# Altium schematic sheet WIFI and BLE.SchDoc
size 420 x 297 mm; SheetNumber: 8; SheetTotal: 16
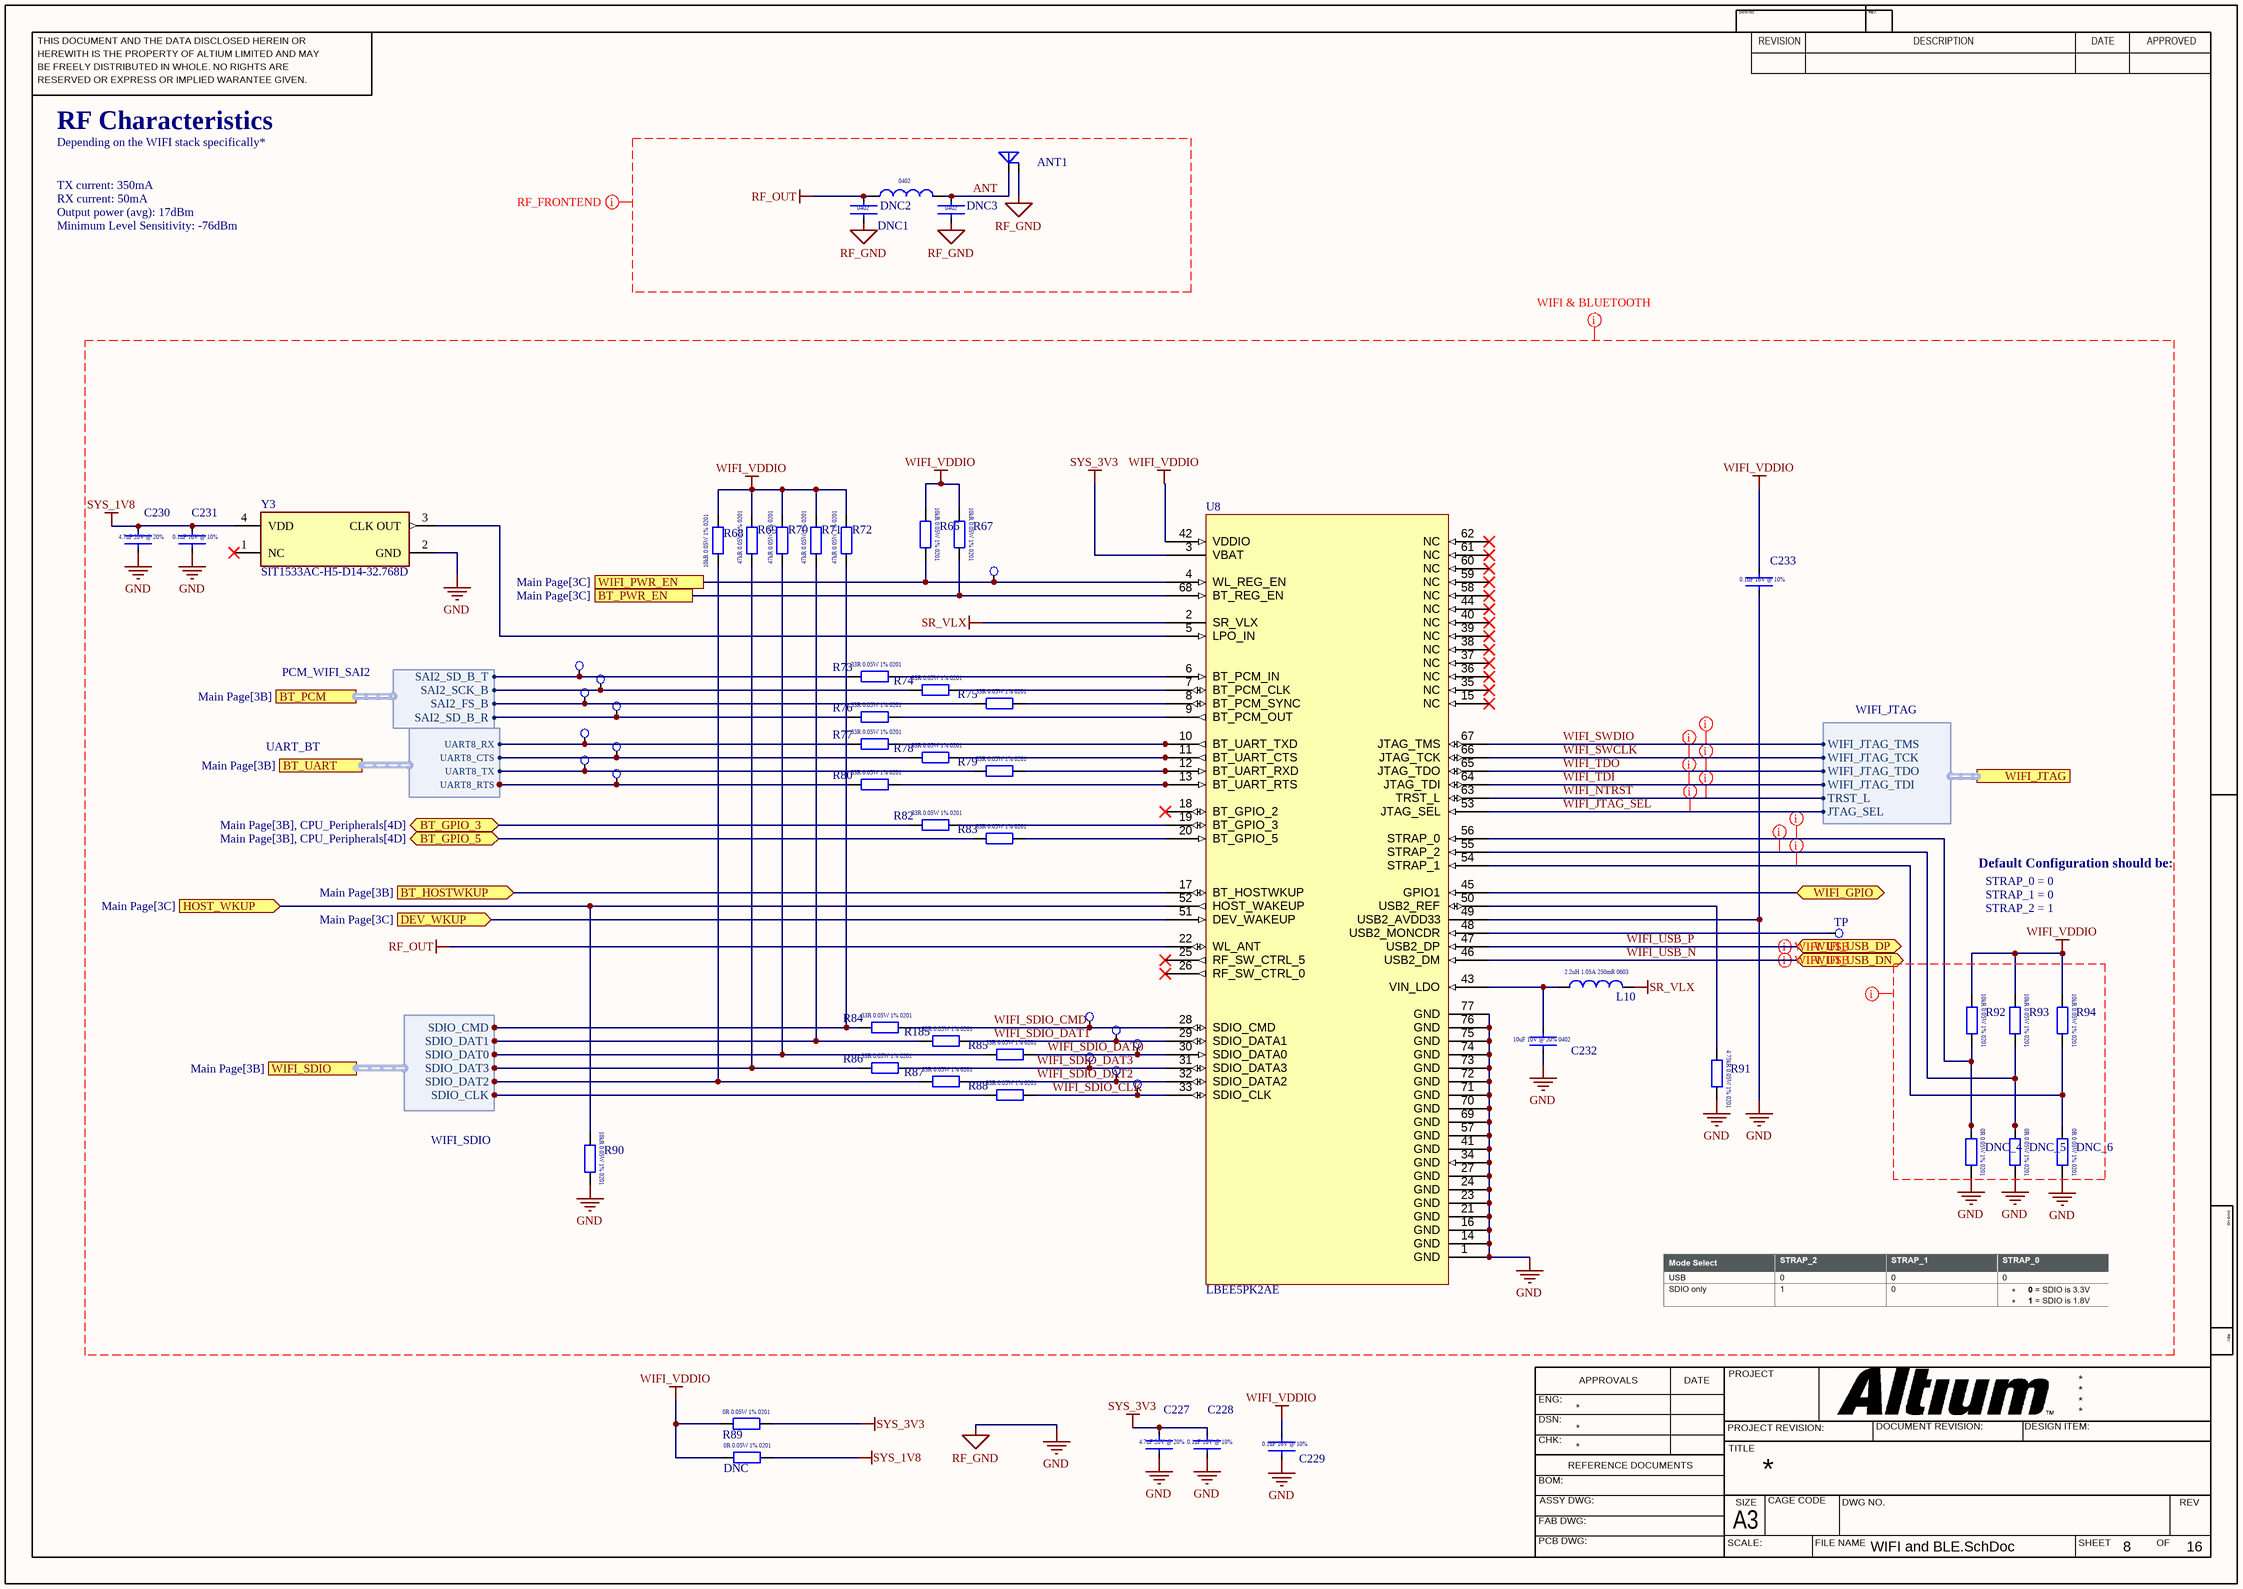
[diagram p0: WIFI and BLE.SchDoc]

## Parts
ANT1  ANT5320LL24R2455A  [ANT5320LL24R2455A]  (value not drawn)
C227  4.7uF  [CAPC1005X06L]  (value not drawn)
C228  0.1uF  [CAPC0603X03L]  (value not drawn)
C229  0.1uF  [CAPC0603X03L]  (value not drawn)
C230  4.7uF  [CAPC1005X06L]  (value not drawn)
C231  0.1uF  [CAPC0603X03L]  (value not drawn)
C232  GRT155R61A106ME13J  [CAPC1005X06L]  (value not drawn)
C233  0.1uF  [CAPC0603X03L]  (value not drawn)
DNC  ERJ-1GN0R00C  [RESC0603X03L]  (value not drawn)
DNC1  RF_GND_PI  [CAPC1005X06L]  (value not drawn)
DNC2  DNC RF Inductor  [RESC1005X04L]  (value not drawn)
DNC3  RF_GND_PI  [CAPC1005X06L]  (value not drawn)
DNC_4  ERJ-1GN0R00C  [RESC0603X03L]  (value not drawn)
DNC_5  ERJ-1GN0R00C  [RESC0603X03L]  (value not drawn)
DNC_6  ERJ-1GN0R00C  [RESC0603X03L]  (value not drawn)
L10  LQM18PN2R2MGHD  [INDC1608LPX08L]  (value not drawn)
R66  ERJ-1GNF1002C  [RESC0603X03L]  (value not drawn)
R67  ERJ-1GNF1002C  [RESC0603X03L]  (value not drawn)
R68  ERJ-1GNF1002C  [RESC0603X03L]  (value not drawn)
R69  AC0201FR-0747KL  [RESC0603X03L]  (value not drawn)
R70  AC0201FR-0747KL  [RESC0603X03L]  (value not drawn)
R71  AC0201FR-0747KL  [RESC0603X03L]  (value not drawn)
R72  AC0201FR-0747KL  [RESC0603X03L]  (value not drawn)
R73  ERJ-1GNF33R0C  [RESC0603X03L]  (value not drawn)
R74  ERJ-1GNF33R0C  [RESC0603X03L]  (value not drawn)
R75  ERJ-1GNF33R0C  [RESC0603X03L]  (value not drawn)
R76  ERJ-1GNF33R0C  [RESC0603X03L]  (value not drawn)
R77  ERJ-1GNF33R0C  [RESC0603X03L]  (value not drawn)
R78  ERJ-1GNF33R0C  [RESC0603X03L]  (value not drawn)
R79  ERJ-1GNF33R0C  [RESC0603X03L]  (value not drawn)
R80  ERJ-1GNF33R0C  [RESC0603X03L]  (value not drawn)
R82  ERJ-1GNF33R0C  [RESC0603X03L]  (value not drawn)
R83  ERJ-1GNF33R0C  [RESC0603X03L]  (value not drawn)
R84  ERJ-1GNF33R0C  [RESC0603X03L]  (value not drawn)
R85  ERJ-1GNF33R0C  [RESC0603X03L]  (value not drawn)
R86  ERJ-1GNF33R0C  [RESC0603X03L]  (value not drawn)
R87  ERJ-1GNF33R0C  [RESC0603X03L]  (value not drawn)
R88  ERJ-1GNF33R0C  [RESC0603X03L]  (value not drawn)
R89  ERJ-1GN0R00C  [RESC0603X03L]  (value not drawn)
R90  ERJ-1GNF1002C  [RESC0603X03L]  (value not drawn)
R91  AC0201FR-074K75L  [RESC0603X03L]  (value not drawn)
R92  ERJ-1GNF1002C  [RESC0603X03L]  (value not drawn)
R93  ERJ-1GNF1002C  [RESC0603X03L]  (value not drawn)
R94  ERJ-1GNF1002C  [RESC0603X03L]  (value not drawn)
R185  ERJ-1GNF33R0C  [RESC0603X03L]  (value not drawn)
TP  Test Point  [Test Point]  (value not drawn)
TP1  Test Point  [Test Point]  (value not drawn)
TP2  Test Point  [Test Point]  (value not drawn)
TP3  Test Point  [Test Point]  (value not drawn)
TP4  Test Point  [Test Point]  (value not drawn)
TP5  Test Point  [Test Point]  (value not drawn)
TP6  Test Point  [Test Point]  (value not drawn)
TP21  Test Point  [Test Point]  (value not drawn)
TP22  Test Point  [Test Point]  (value not drawn)
TP23  Test Point  [Test Point]  (value not drawn)
TP24  Test Point  [Test Point]  (value not drawn)
TP25  Test Point  [Test Point]  (value not drawn)
TP26  Test Point  [Test Point]  (value not drawn)
TP27  Test Point  [Test Point]  (value not drawn)
TP28  Test Point  [Test Point]  (value not drawn)
TP40  Test Point  [Test Point]  (value not drawn)
U8  LBEE5PK2AE  [LBEE5PK2AE]
Y3  SIT1533AC-H5-D14-32.768D  [FP-SiT1533-H-MFG]

## Ports
BT_GPIO_3 (bidir, see Main Page[3B], CPU_Peripherals[4D]), BT_GPIO_5 (bidir, see Main Page[3B], CPU_Peripherals[4D]), BT_HOSTWKUP (in, see Main Page[3B]), BT_PCM (harness PCM_WIFI_SAI2, see Main Page[3B]), BT_PWR_EN (see Main Page[3C]), BT_UART (harness UART_BT, see Main Page[3B]), DEV_WKUP (in, see Main Page[3C]), HOST_WKUP (in, see Main Page[3C]), WIFI_GPIO (bidir, see Main Page[3B], CPU_Peripherals[4E]), WIFI_JTAG (harness WIFI_JTAG, see Main Page[2B], Connector A[1B]), WIFI_PWR_EN (see Main Page[3C]), WIFI_SDIO (harness WIFI_SDIO, see Main Page[3B]), WIFI_USB_DN (bidir, see Main Page[3C]), WIFI_USB_DP (bidir, see Main Page[3C])

## Harnesses
WIFI_JTAG: WIFI_JTAG_TMS, WIFI_JTAG_TCK, WIFI_JTAG_TDO, WIFI_JTAG_TDI, TRST_L, JTAG_SEL
PCM_WIFI_SAI2: SAI2_FS_B, SAI2_SCK_B, SAI2_SD_B_R, SAI2_SD_B_T
WIFI_SDIO: SDIO_CLK, SDIO_CMD, SDIO_DAT0, SDIO_DAT1, SDIO_DAT2, SDIO_DAT3
UART_BT: UART8_CTS, UART8_RTS, UART8_RX, UART8_TX

## Nets
GND: ANT1.3(GND) C227.1 C228.1 C229.1 C230.1 C231.1 C232.1 C233.1 DNC1.1 DNC3.1 DNC_4.2 DNC_5.2 DNC_6.2 R90.2 R91.2 U8.1(GND) U8.14(GND) U8.16(GND) U8.21(GND) U8.23(GND) U8.24(GND) U8.27(GND) U8.34(GND) U8.41(GND) U8.49(USB2_AVDD33) U8.57(GND) U8.69(GND) U8.70(GND) U8.71(GND) U8.72(GND) U8.73(GND) U8.74(GND) U8.75(GND) U8.76(GND) U8.77(GND) Y3.2(GND)  [also labelled RF_GND]
RF_OUT: DNC1.2 DNC2.1 U8.22(WL_ANT)
SR_VLX: L10.2 U8.2(SR_VLX)
SYS_1V8: C230.2 C231.2 DNC.2 Y3.4(VDD)
SYS_3V3: C227.2 C228.2 R89.2 U8.3(VBAT)
WIFI_VDDIO: C229.2 C233.2 DNC.1 R66.1 R67.1 R68.2 R69.2 R70.2 R71.2 R72.2 R89.1 R92.1 R93.1 R94.1 U8.42(VDDIO)
ANT: ANT1.1(FEED) DNC2.2 DNC3.2
BT_GPIO_3: R82.1 ; port BT_GPIO_3
BT_GPIO_5: R83.1 ; port BT_GPIO_5
BT_HOSTWKUP: U8.17(BT_HOSTWKUP) ; port BT_HOSTWKUP
BT_PWR_EN: R67.2 U8.68(BT_REG_EN) ; port BT_PWR_EN
DEV_WKUP: U8.51(DEV_WAKEUP) ; port DEV_WKUP
HOST_WKUP: R90.1 U8.52(HOST_WAKEUP) ; port HOST_WKUP
WIFI_GPIO: U8.45(GPIO1) ; port WIFI_GPIO
WIFI_JTAG_SEL: U8.53(JTAG_SEL) ; port WIFI_JTAG.JTAG_SEL
WIFI_NTRST: U8.63(TRST_L) ; port WIFI_JTAG.TRST_L
WIFI_PWR_EN: R66.2 TP40.12 U8.4(WL_REG_EN) ; port WIFI_PWR_EN
WIFI_SDIO_CLK: R88.2 TP6.12 U8.33(SDIO_CLK)
WIFI_SDIO_CMD: R84.2 TP1.12 U8.28(SDIO_CMD)
WIFI_SDIO_DAT0: R85.2 TP3.12 U8.30(SDIO_DATA0)
WIFI_SDIO_DAT1: R185.2 TP2.12 U8.29(SDIO_DATA1)
WIFI_SDIO_DAT2: R87.2 TP5.12 U8.32(SDIO_DATA2)
WIFI_SDIO_DAT3: R86.2 TP4.12 U8.31(SDIO_DATA3)
WIFI_SWCLK: U8.66(JTAG_TCK) ; port WIFI_JTAG.WIFI_JTAG_TCK
WIFI_SWDIO: U8.67(JTAG_TMS) ; port WIFI_JTAG.WIFI_JTAG_TMS
WIFI_TDI: U8.64(JTAG_TDI) ; port WIFI_JTAG.WIFI_JTAG_TDI
WIFI_TDO: U8.65(JTAG_TDO) ; port WIFI_JTAG.WIFI_JTAG_TDO
WIFI_USB_N: U8.46(USB2_DM) ; port WIFI_USB_DN
WIFI_USB_P: U8.47(USB2_DP) ; port WIFI_USB_DP
NetC232_2: C232.2 L10.1 U8.43(VIN_LDO)
NetDNC_4_1: DNC_4.1 R92.2 U8.56(STRAP_0)
NetDNC_5_1: DNC_5.1 R93.2 U8.55(STRAP_2)
NetDNC_6_1: DNC_6.1 R94.2 U8.54(STRAP_1)
NetR68_1: R68.1 R87.1 ; port WIFI_SDIO.SDIO_DAT2
NetR69_1: R69.1 R86.1 ; port WIFI_SDIO.SDIO_DAT3
NetR70_1: R70.1 R85.1 ; port WIFI_SDIO.SDIO_DAT0
NetR71_1: R71.1 R185.1 ; port WIFI_SDIO.SDIO_DAT1
NetR72_1: R72.1 R84.1 ; port WIFI_SDIO.SDIO_CMD
NetR73_1: R73.1 TP21.12 ; port BT_PCM.SAI2_SD_B_T
NetR73_2: R73.2 U8.6(BT_PCM_IN)
NetR74_1: R74.1 TP22.12 ; port BT_PCM.SAI2_SCK_B
NetR74_2: R74.2 U8.7(BT_PCM_CLK)
NetR75_1: R75.1 TP23.12 ; port BT_PCM.SAI2_FS_B
NetR75_2: R75.2 U8.8(BT_PCM_SYNC)
NetR76_1: R76.1 TP24.12 ; port BT_PCM.SAI2_SD_B_R
NetR76_2: R76.2 U8.9(BT_PCM_OUT)
NetR77_1: R77.1 TP25.12 ; port BT_UART.UART8_RX
NetR77_2: R77.2 U8.10(BT_UART_TXD)
NetR78_1: R78.1 TP26.12 ; port BT_UART.UART8_CTS
NetR78_2: R78.2 U8.11(BT_UART_CTS)
NetR79_1: R79.1 TP27.12 ; port BT_UART.UART8_TX
NetR79_2: R79.2 U8.12(BT_UART_RXD)
NetR80_1: R80.1 TP28.12 ; port BT_UART.UART8_RTS
NetR80_2: R80.2 U8.13(BT_UART_RTS)
NetR82_2: R82.2 U8.19(BT_GPIO_3)
NetR83_2: R83.2 U8.20(BT_GPIO_5)
NetR88_1: R88.1 ; port WIFI_SDIO.SDIO_CLK
NetR91_1: R91.1 U8.50(USB2_REF)
NetTP_12: TP.12 U8.48(USB2_MONCDR)
NetU8_5: U8.5(LPO_IN) Y3.3(CLK_OUT)

Not connected (* = marked no-connect by the designer): U8 15(NC)* 18(BT_GPIO_2)* 25(RF_SW_CTRL_5)* 26(RF_SW_CTRL_0)* 35(NC)* 36(NC)* 37(NC)* 38(NC)* 39(NC)* 40(NC)* 44(NC)* 58(NC)* 59(NC)* 60(NC)* 61(NC)* 62(NC)*; Y3 1(NC)*

## Layout directives
net class RF Frontend: ANT, RF_GND, RF_OUT
net class Wifi Strapping Resistors: GND, RF_OUT, SR_VLX, SYS_1V8, SYS_3V3, WIFI_JTAG_SEL, WIFI_NTRST, WIFI_SDIO_CLK, WIFI_SDIO_CMD, WIFI_SDIO_DAT0, WIFI_SDIO_DAT1, WIFI_SDIO_DAT2, WIFI_SDIO_DAT3, WIFI_SWCLK, WIFI_SWDIO, WIFI_TDI, WIFI_TDO, WIFI_USB_N, WIFI_USB_P, WIFI_VDDIO
differential pair: WIFI_USB_N, WIFI_USB_P
net class WiFi & BlueTooth: GND, RF_OUT, SR_VLX, SYS_1V8, SYS_3V3, WIFI_JTAG_SEL, WIFI_NTRST, WIFI_SDIO_CLK, WIFI_SDIO_CMD, WIFI_SDIO_DAT0, WIFI_SDIO_DAT1, WIFI_SDIO_DAT2, WIFI_SDIO_DAT3, WIFI_SWCLK, WIFI_SWDIO, WIFI_TDI, WIFI_TDO, WIFI_USB_N, WIFI_USB_P, WIFI_VDDIO
net class WIFI STRAP GPIO: NetDNC_4_1, NetDNC_5_1, NetDNC_6_1
net class WIFI_JTAG; net class *: WIFI_NTRST, WIFI_SWCLK, WIFI_SWDIO, WIFI_TDI, WIFI_TDO
net class WIFI_JTAG: WIFI_JTAG_SEL

## Notes on the sheet
- RF Characteristics
- TX current: 350mA
- Depending on the WIFI stack specifically*
- RX current: 50mA
- Output power (avg): 17dBm
- Minimum Level Sensitivity: -76dBm
- Default Configuration should be:
- STRAP_0 = 0
- STRAP_1 = 0
- STRAP_2 = 1
- THIS DOCUMENT AND THE DATA DISCLOSED HEREIN OR
- HEREWITH IS THE PROPERTY OF ALTIUM LIMITED AND MAY
- DWG NO:
- REVISION
- REV:
- DESCRIPTION
- DATE
- APPROVED
- BE FREELY DISTRIBUTED IN WHOLE. NO RIGHTS ARE
- RESERVED OR EXPRESS OR IMPLIED WARANTEE GIVEN.
- ENG:
- APPROVALS
- PROJECT
- DSN:
- CHK:
- REFERENCE DOCUMENTS
- PROJECT REVISION:
- TITLE
- DOCUMENT REVISION:
- DESIGN ITEM:
- BOM:
- FAB DWG:
- PCB DWG:
- ASSY DWG:
- SCALE:
- A3
- SIZE
- CAGE CODE
- FILE NAME
- DWG NO.
- SHEET
- OF
- REV
- (in symbol AC0201FR-074K75L) 4.75kR 0.05W 1% 0201
- (in symbol AC0201FR-0747KL) 47kR 0.05W 1% 0201
- (in symbol CL05A475MO5NUNC) 4.7uF 20V @ 20%
- (in symbol DNC RF Inductor) 0402
- (in symbol ERJ-1GN0R00C) 0R 0.05W 1% 0201
- (in symbol ERJ-1GNF33R0C) 33R 0.05W 1% 0201
- (in symbol ERJ-1GNF1002C) 10kR 0.05W 1% 0201
- (in symbol GRM033R61E104KE14J) 0.1uF 16V @ 10%
- (in symbol GRT155R61A106ME13J) 10uF 10V @ 20% 0402
- (in symbol LQM18PN2R2MGHD) 2.2uH 1.05A 250mR 0603
- (in symbol RF_GND_PI) 0402

## Library data of the parts
ANT1 = ANT5320LL24R2455A: RF ANTENNA WLAN Chip Solder Surface Mount
C227 C230 = CL05A475MO5NUNC: 4.7 µF ±20% 16V Ceramic Capacitor X5R 0402 (1005 Metric)
C228 C229 C231 C233 = GRM033R61E104KE14J: 0.1 µF ±10% 25V Ceramic Capacitor X5R 0201 (0603 Metric)0.1 µF ±10% 25V Ceramic Capacitor X5R 0201 (0603 Metric)
C232 = GRT155R61A106ME13J: 10 µF ±20% 10V Ceramic Capacitor X5R 0402 (1005 Metric); ComponentLink1Description: New link; ComponentLink1URL: https://www.digikey.com.au/en/products/detail/murata-electronics/GRT155R61A106ME13J/19115510
DNC DNC_4-DNC_6 R89 = ERJ-1GN0R00C: 0 Ohms Jumper Chip Resistor 0201 (0603 Metric) Thick Film; ComponentLink1Description: New link; ComponentLink1URL: https://www.digikey.com.au/en/products/detail/panasonic-electronic-components/ERJ-1GN0R00C/3982613
DNC1 DNC3 = RF_GND_PI: Pi filter chip antenna, Do not connect!
DNC2 = DNC RF Inductor: Inductor for PI filter, DNC
L10 = LQM18PN2R2MGHD: 2.2 µH Shielded Multilayer Inductor 1.05 A 250mOhm Max 0603 (1608 Metric); ComponentLink1Description: New link; ComponentLink1URL: https://www.digikey.com.au/en/products/detail/murata-electronics/LQM18PN2R2MGHD/6606107
R66-R68 R90 R92-R94 = ERJ-1GNF1002C: 10 kOhms ±1% 0.05W, 1/20W Chip Resistor 0201 (0603 Metric) Thick Film; ComponentLink1Description: New link; ComponentLink1URL: https://www.digikey.com.au/en/products/detail/panasonic-electronic-components/ERJ-1GNF1002C/2036226
R69-R72 = AC0201FR-0747KL: 47 kOhms ±1% 0.05W, 1/20W Chip Resistor 0201 (0603 Metric) Automotive AEC-Q200, Moisture Resistant Thick Film; ComponentLink1Description: New link; ComponentLink1URL: https://www.digikey.com.au/en/products/detail/yageo/AC0201FR-0747KL/5894664
R73-R80 R82-R88 R185 = ERJ-1GNF33R0C: 33 Ohms ±1% 0.05W, 1/20W Chip Resistor 0201 (0603 Metric) Thick Film; ComponentLink1Description: New link; ComponentLink1URL: https://www.digikey.com.au/en/products/detail/panasonic-electronic-components/ERJ-1GNF33R0C/2035941
R91 = AC0201FR-074K75L: 4.75 kOhms ±1% 0.05W, 1/20W Chip Resistor 0201 (0603 Metric) Automotive AEC-Q200, Moisture Resistant Thick Film; ComponentLink1Description: New link; ComponentLink1URL: https://www.digikey.com.au/en/products/detail/yageo/AC0201FR-074K75L/5894685
U8 = LBEE5PK2AE: Bluetooth, WiFi 802.11a/b/g/n/ac, Bluetooth v5.2 Transceiver Module 2.412GHz ~ 2.472GHz, 5.18GHz ~ 5.825GHz Surface Mount
Y3 = CMP-25159-259659-1: MEMS OSC XO 32.7680KHZ LVCMOS; Frequency: 32.768kHz; Max Supply Current: 1.3uA; Frequency Stability: 75ppm; Mount: Surface Mount; Height: 0.024inch; Case/Package: SMD/SMT; Width: 0.047inch; Packaging: Cut Tape; Series: SiT1533; Max Operating Temperature: 70°C; RoHS Compliant: Yes; Length: 0.079inch; Min Operating Temperature: -10°C